# EAGLE schematic mouseHatbiggerHBridge2 (EAGLE 9.6.2)
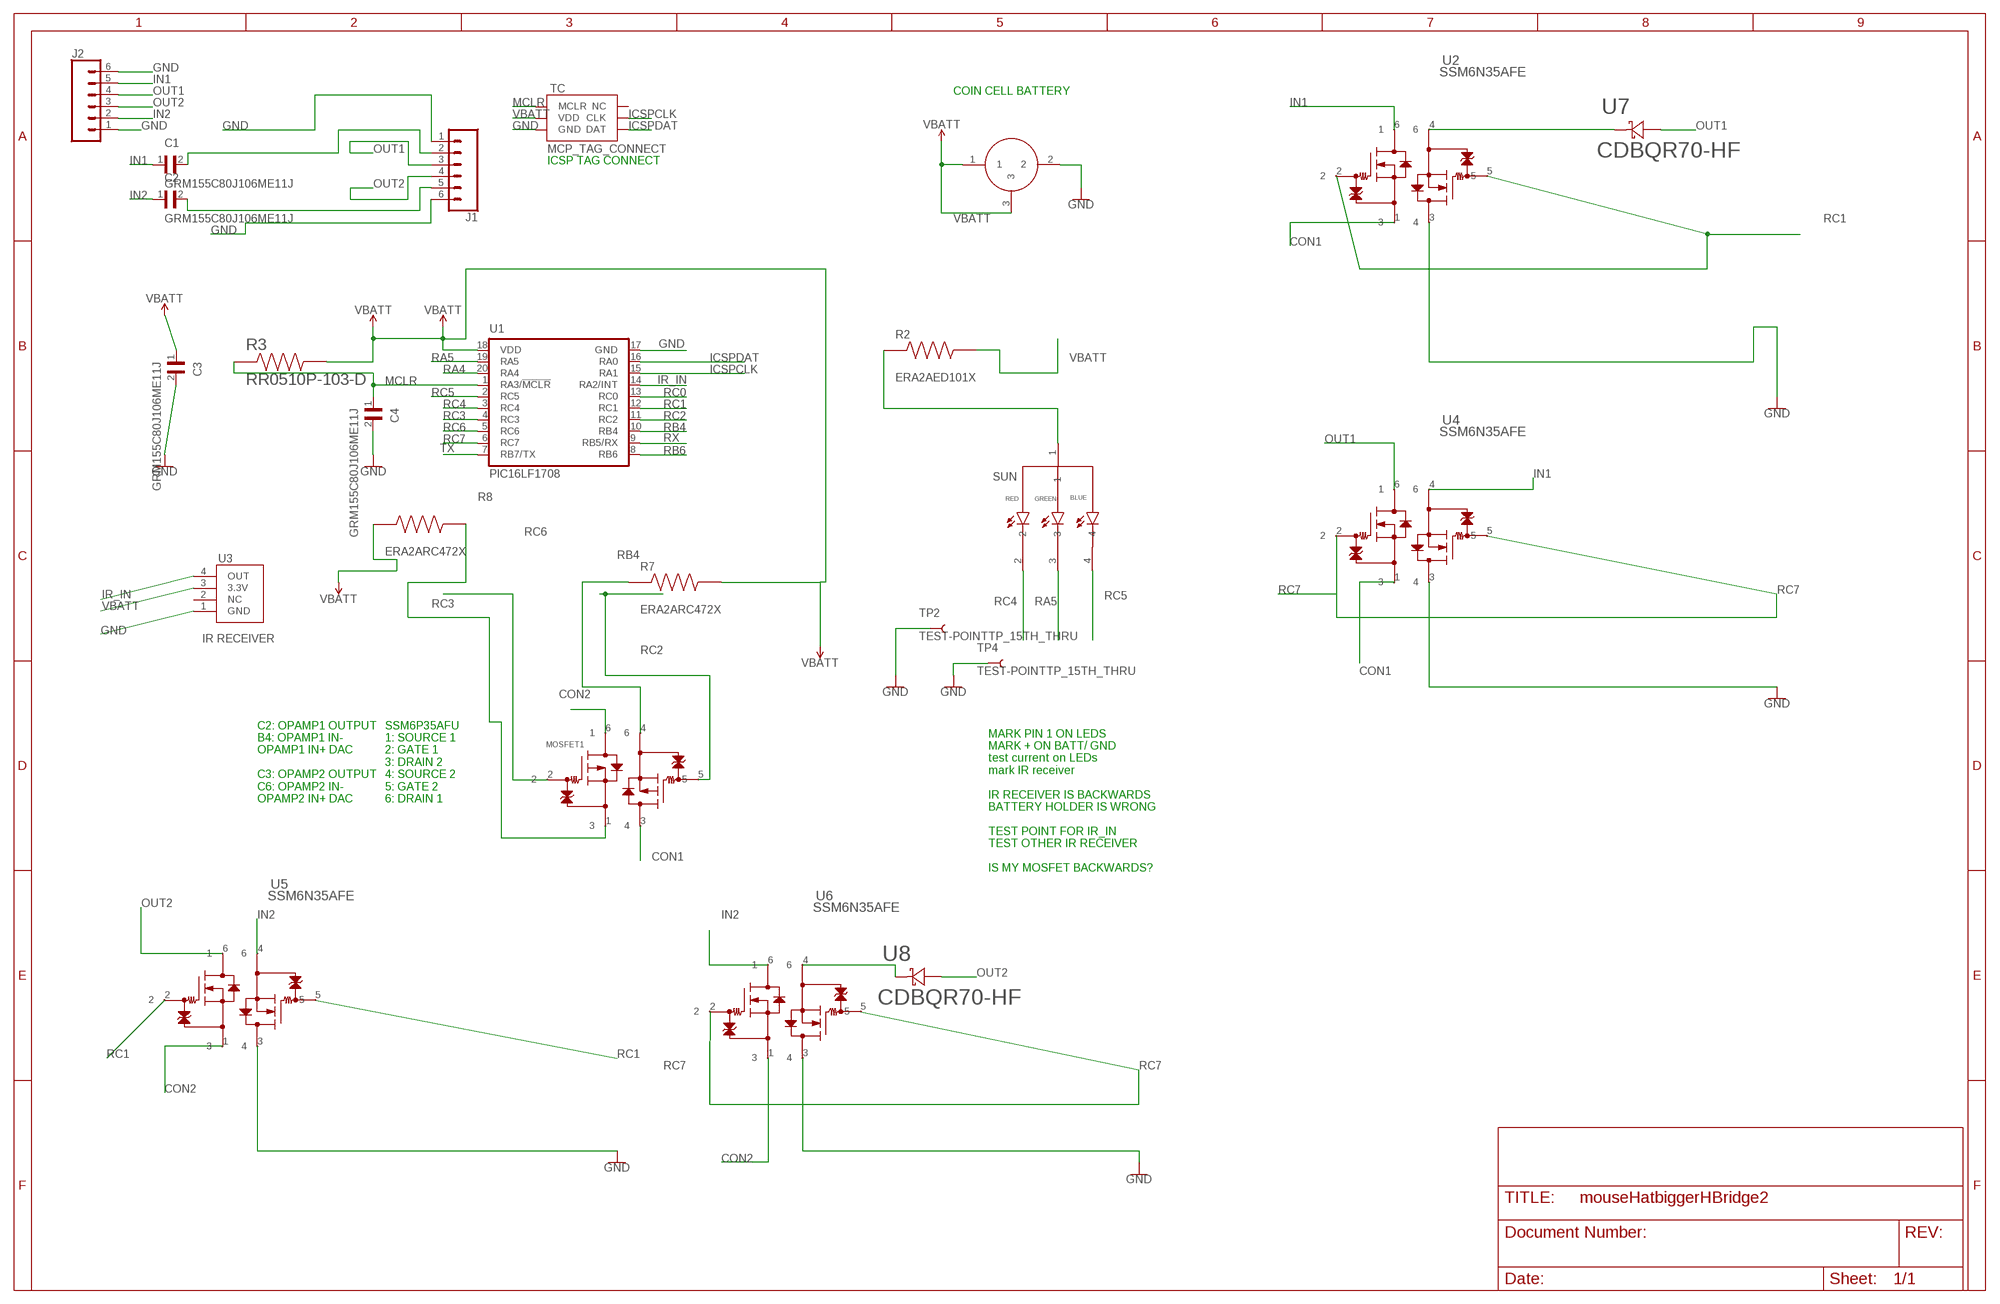
[diagram p0: schematic, sheet 1]

## Parts
C1  GRM155C80J106ME11J  [CAPC1005X70N]
C2  GRM155C80J106ME11J  [CAPC1005X70N]
C3  GRM155C80J106ME11J  [CAPC1005X70N]
C4  GRM155C80J106ME11J  [CAPC1005X70N]
J1  CONN_06NO_SILK_FEMALE_PTH  [1X06_NO_SILK]
J2  CONN_06NO_SILK_FEMALE_PTH  [1X06_NO_SILK]
MOSFET1  SSM6P35AFE,LF  [ES6_TOS]
R2  ERA2AED101X  [RES_ERA2AED101X]
R3  RR0510P-103-D  [RESC1005X40N]
R7  ERA2ARC472X  [RES_ERA2ARC472X]
R8  ERA2ARC472X  [RES_ERA2ARC472X]
TC  MCP_TAG_CONNECT  [TAG_CONNECT_MCP]
TP2  TEST-POINTTP_15TH_THRU  [TP_15TH]
TP4  TEST-POINTTP_15TH_THRU  [TP_15TH]
U1  PIC16LF1708  PIC16LF1708QFN20  [QFN20]
U2  SSM6N35AFE  [ES6]
U3  IR RECEIVER  TSOP6238  [TSOP6238]
U4  SSM6N35AFE  [ES6]
U5  SSM6N35AFE  [ES6]
U6  SSM6N35AFE  [ES6]
U7  CDBQR70-HF  [CDBQR]
U8  CDBQR70-HF  [CDBQR]
U$2  10MM_BATT_HOLDER  [10MM_BATT_HOLDER]
U$6  SUN  LED_RGB_SUN  [LED_RGB_SUN]

## Nets
CON1: MOSFET1.3 U2.1 U4.1
CON2: MOSFET1.6 U5.1 U6.1
GND: C3.2 C4.2 J1.1 J1.6 J2.1 J2.6 TC.3(GND) TP2.P$1 TP4.P$1 U1.17(GND) U2.3 U3.1(GND) U4.3 U5.3 U6.3 U$2.2
ICSPCLK: TC.5(CLK) U1.15(RA1)
ICSPDAT: TC.4(DAT) U1.16(RA0)
IN1: C1.1 J2.5 U2.6 U4.4
IN2: C2.1 J2.2 U5.4 U6.6
IR_IN: U1.14(RA2/INT) U3.4(OUT)
MCLR: C4.1 R3.1 TC.1(MCLR) U1.1(RA3/!MCLR)
N$2: C2.2 J1.5
N$3: R2.1 U$6.1
N$4: C1.2 J1.2
N$5: U2.4 U7.1
N$6: U6.4 U8.1
OUT1: J1.3 J2.4 U4.6 U7.2
OUT2: J1.4 J2.3 U5.6 U8.2
RA4: U1.20(RA4)
RA5: U1.19(RA5) U$6.3
RB4: MOSFET1.4 R7.1 U1.10(RB4)
RB6: U1.8(RB6)
RC0: U1.13(RC0)
RC1: U1.12(RC1) U2.2 U2.5 U5.2 U5.5
RC2: MOSFET1.5 U1.11(RC2)
RC3: MOSFET1.2 U1.4(RC3)
RC4: U1.3(RC4) U$6.2
RC5: U1.2(RC5) U$6.4
RC6: MOSFET1.1 R8.2 U1.5(RC6)
RC7: U1.6(RC7) U4.2 U4.5 U6.2 U6.5
RX: U1.9(RB5/RX)
TX: U1.7(RB7/TX)
VBATT: C3.1 R2.2 R3.2 R7.2 R8.1 TC.2(VDD) U1.18(VDD) U3.3(3.3V) U$2.1 U$2.3
Unconnected: TC.6(NC) U3.2(NC)

## Notes on the sheet
- COIN CELL BATTERY
- ICSP TAG CONNECT
- C2: OPAMP1 OUTPUT
  B4: OPAMP1 IN-
  OPAMP1 IN+ DAC
  
  C3: OPAMP2 OUTPUT
  C6: OPAMP2 IN-
  OPAMP2 IN+ DAC
- SSM6P35AFU
  1: SOURCE 1
  2: GATE 1
  3: DRAIN 2
  4: SOURCE 2
  5: GATE 2
  6: DRAIN 1
- MARK PIN 1 ON LEDS
  MARK + ON BATT/ GND
  test current on LEDs
  mark IR receiver
  
  IR RECEIVER IS BACKWARDS
  BATTERY HOLDER IS WRONG
  
  TEST POINT FOR IR_IN
  TEST OTHER IR RECEIVER
  
  IS MY MOSFET BACKWARDS?

## Library data of the parts
C1-C4 = GRM155C80J106ME11J:GRM155C80J106ME11J; DESCRIPTION: 10µF ±20% 6.3V Ceramic Capacitor X6S 0402 (1005 Metric); DIGI-KEY_PART_NUMBER: 490-18210-1-ND; MF: Murata Electronics; MP: GRM155C80J106ME11J; PACKAGE: 1005 Murata
J1 J2 = SparkFun-Connectors:CONN_06: Multi connection point. Often used as Generic Header-pin footprint for 0.1 inch spaced/style header connections On any of the 0.1 inch spaced packages, you can populate with these: Break Away Headers - Straight <https://www.sparkfun.com/products/116> (PRT-00116) Break Away Male Headers - Right Angle <https://www.sparkfun.com/products/553> (PRT-00553) Female Headers <https://www.sparkfun.com/products/115> (PRT-00115) Break Away Headers - Machine Pin <https://www.sparkfun.com/products/117> (PRT-00117) Break Away Female Headers - Swiss Machine Pin <https://www.sparkfun.com/products/743> (PRT-00743) Arduino Stackable Header - 6 Pin <https://www.sparkfun.com/products/9280> (PRT-09280) For SCREWTERMINALS and SPRING TERMINALS visit here: Screw Terimnals on SparkFun.com <https://www.sparkfun.com/search/results?term=Screw+Terminals> (5mm/3.5mm/2.54mm spacing) This device is also useful as a general connection point to wire up your design to another part of your project. Our various solder wires solder well into these plated through hole pads. Hook-Up Wire - Assortment (Stranded, 22 AWG) <https://www.sparkfun.com/products/11375> (PRT-11375) Hook-Up Wire - Assortment (Solid Core, 22 AWG) <https://www.sparkfun.com/products/11367> (PRT-11367) View the entire wire category on our website here <https://www.sparkfun.com/categories/141>; PROD_ID: CONN-08437
MOSFET1 = smallTransistorPackage:SSM6P35AFE,LF; COPYRIGHT: Copyright (C) 2021 Ultra Librarian. All rights reserved.; DIGI-KEY_PART_NUMBER_1: SSM6P35AFELFTR-ND; DIGI-KEY_PART_NUMBER_2: SSM6P35AFELFCT-ND; DIGI-KEY_PART_NUMBER_3: SSM6P35AFELFDKR-ND; MANUFACTURER_PART_NUMBER: SSM6P35AFE,LF; MFR_NAME: Toshiba Electronic Devices & Storage Co.
R2 = ERA2AED101X:ERA2AED101X; DESCRIPTION: 100 Ohms ±0.5% 0.063W, 1/16W Chip Resistor 0402 (1005 Metric) Automotive AEC-Q200 Thin Film; DIGI-KEY_PART_NUMBER: P100DECT-ND; MF: Panasonic; MP: ERA2AED101X; PACKAGE: 1005-2 Panasonic
R3 = RR0510P-103-D:RR0510P-103-D: RES, THIN FILM, 10K, 0.5%, 0.063W, 0402, REEL; DESCRIPTION: 10 kOhms ±0.5% 0.063W, 1/16W Chip Resistor 0402 (1005 Metric) Thin Film; DIGI-KEY_PART_NUMBER: RR05P10.0KDCT-ND; MF: Susumu; MP: RR0510P-103-D; PACKAGE: 1005 Panasonic Electronic Components; PURCHASE-URL: https://pricing.snapeda.com/search/part/RR0510P-103-D/?ref=eda
R7 R8 = ERA2ARC472X:ERA2ARC472X; DESCRIPTION: 4.7 kOhms ±0.25% 0.063W, 1/16W Chip Resistor 0402 (1005 Metric) Automotive AEC-Q200 Thin Film; DIGI-KEY_PART_NUMBER: P4.7KCQCT-ND; MF: Panasonic; MP: ERA2ARC472X; PACKAGE: 1005-2 Panasonic
TC = SophiEaglev9:MCP_TAG_CONNECT
TP2 TP4 = SparkFun-Connectors:TEST-POINT: SparkFun Test Points Bare copper test points for troubleshooting or In-Circuit-Testing. These are used by our Production team for verifying production board runs using pogo-pins on test beds. SparkFun Products: SparkFun LSM9DS1 Breakout <https://www.sparkfun.com/products/13284> SparkFun PSOC <https://www.sparkfun.com/products/13714> SparkFun Load Cell Amplifier <https://www.sparkfun.com/products/13879>
U1 = SophiEaglev9:PIC16LF1708
U2 U4-U6 = nMOSSmall:SSM6N35AFE; COPYRIGHT: Copyright (C) 2022 Ultra Librarian. All rights reserved.; DIGI-KEY_PART_NUMBER_1: SSM6N35AFELF-ND; MANUFACTURER_PART_NUMBER: SSM6N35AFE; MFR_NAME: Toshiba Electronic Devices & Storage Co.
U3 = SophiEaglev9:TSOP6238
U7 U8 = SchottkyDiodeFormousehat:CDBQR70-HF; COPYRIGHT: Copyright (C) 2022 Ultra Librarian. All rights reserved.; DIGI-KEY_PART_NUMBER_1: 641-1947-1-ND; DIGI-KEY_PART_NUMBER_2: 641-1947-2-ND; DIGI-KEY_PART_NUMBER_3: 641-1947-6-ND; DIGI-KEY_PART_NUMBER_4: CDBQR70-HF-ND; MANUFACTURER_PART_NUMBER: CDBQR70-HF; MFR_NAME: Comchip
U$2 = SophiEaglev9:10MM_BATT_HOLDER
U$6 = SophiEaglev9:LED_RGB_SUN